# Altium schematic sheet med_filter.SchDoc
size A
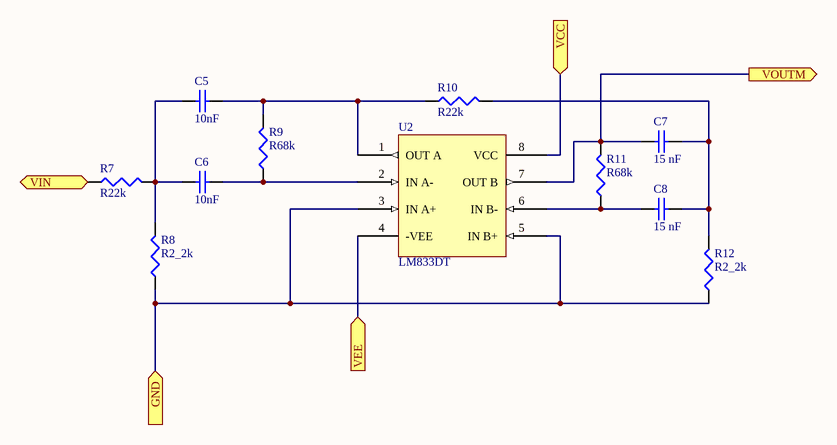
[diagram p0: med_filter.SchDoc]

## Parts
C5  10nF  [C0603]
C6  10nF  [C0603]
C7  15 nF  [C0603]
C8  15 nF  [C0603]
R7  R22k  [R0603]
R8  R2_2k  [R0603]
R9  R68k  [R0603]
R10  R22k  [R0603]
R11  R68k  [R0603]
R12  R2_2k  [R0603]
U2  LM833DT  [soic8]

## Ports
GND (in), VCC (in), VEE (in), VIN (in), VOUTM (out)

## Nets
GND: R8.1 R12.1 U2.3(IN_A+) U2.5(IN_B+) ; port GND
VCC: U2.8(VCC) ; port VCC
VEE: U2.4(-VEE) ; port VEE
VIN: R7.1 ; port VIN
VOUTM: C7.1 R11.2 U2.7(OUT_B) ; port VOUTM
NetC5_1: C5.1 C6.1 R7.2 R8.2
NetC5_2: C5.2 R9.2 R10.1 U2.1(OUT_A)
NetC6_2: C6.2 R9.1 U2.2(IN_A-)
NetC7_2: C7.2 C8.2 R10.2 R12.2
NetC8_1: C8.1 R11.1 U2.6(IN_B-)

## Library data of the parts
C5 C6 = C10nF: 10 nF Surface Mount Capacitor; Manufacturer: Murata Electronics North America; Manufacturer Part Number: GRM188R70J103KA01D; Capacitance: 10000pF; Tolerance: ±10%; Voltage - Rated: 6.3V; Temperature Coefficient: X7R; Supplier 1: Digi-Key; RoHS: RoHS Compliant; Category: Capacitors; Stock 1: 37902; Pricing 1: 1=0.1, 10=0.049, 50=0.0266, 100=0.0226, 250=0.01844, 500=0.01578, 1000=0.0123 (USD); Packaging: Digi-Reel®; Part Status: Active; Operating Temperature: -55°C ~ 125°C; Features: -; Ratings: -; Applications: General Purpose; Mounting Type: Surface Mount, MLCC; Package / Case: 0603 (1608 Metric); Size / Dimension: 0.063" L x 0.031" W (1.60mm x 0.80mm); Height - Seated (Max): -; Thickness (Max): 0.035" (0.90mm); Lead Spacing: -; Lead Style: -; ComponentLink1URL: http://www.murata.com/~/media/webrenewal/support/library/catalog/products/capacitor/mlcc/c02e.pdf; ComponentLink1Description: http://www.murata.com/~/media/webrenewal/support/library/catalog/products/capacitor/mlcc/c02e.pdf; Supplier Part Number 1: 490-9729-6-ND
C7 C8 = C15nF: 15 nF Surface Mount Capacitor; Manufacturer: Murata Electronics North America; Manufacturer Part Number: GRM188R71H153KA01D; Capacitance: 0.015µF; Tolerance: ±10%; Voltage - Rated: 50V; Temperature Coefficient: X7R; Supplier 1: Digi-Key; RoHS: RoHS Compliant; Category: Capacitors; Stock 1: 98716; Pricing 1: 1=0.1, 10=0.043, 50=0.0234, 100=0.0198, 250=0.0162, 500=0.01386, 1000=0.0108 (USD); Packaging: Digi-Reel®; Part Status: Active; Operating Temperature: -55°C ~ 125°C; Features: -; Ratings: -; Applications: General Purpose; Mounting Type: Surface Mount, MLCC; Package / Case: 0603 (1608 Metric); Size / Dimension: 0.063" L x 0.031" W (1.60mm x 0.80mm); Height - Seated (Max): -; Thickness (Max): 0.035" (0.90mm); Lead Spacing: -; Lead Style: -; ComponentLink1URL: http://www.murata.com/~/media/webrenewal/support/library/catalog/products/capacitor/mlcc/c02e.pdf; ComponentLink1Description: http://www.murata.com/~/media/webrenewal/support/library/catalog/products/capacitor/mlcc/c02e.pdf; Supplier Part Number 1: 490-1514-6-ND
R7 R10 = R22k: 22k Ohms Surface Mount Resistor; Manufacturer: Yageo; Manufacturer Part Number: RC0603FR-0722KL; Tolerance: ±1%; Power (Watts): 0.1W, 1/10W; Temperature Coefficient: ±100ppm/°C; Supplier 1: Digi-Key; RoHS: RoHS Compliant; Category: Resistors; Stock 1: 2279950; Pricing 1: 1=0.1, 10=0.013, 25=0.0092, 50=0.007, 100=0.0052, 250=0.00396, 500=0.00316, 1000=0.00233 (USD); Packaging: Digi-Reel®; Part Status: Active; Resistance (Ohms): 22k; Composition: Thick Film; Features: Moisture Resistant; Operating Temperature: -55°C ~ 155°C; Package / Case: 0603 (1608 Metric); Supplier Device Package: 0603; Size / Dimension: 0.063" L x 0.031" W (1.60mm x 0.80mm); Height - Seated (Max): 0.022" (0.55mm); Number of Terminations: 2; Failure Rate: -; ComponentLink1URL: http://www.yageo.com/NewPortal/yageodocoutput?fileName=/pdf/R-Chip/PYu-RC_Group_51_RoHS_L_4.pdf; ComponentLink1Description: http://www.yageo.com/NewPortal/yageodocoutput?fileName=/pdf/R-Chip/PYu-RC_Group_51_RoHS_L_4.pdf; Supplier Part Number 1: 311-22.0KHRDKR-ND
R8 R12 = R2_2k: 2.2k Ohms Surface Mount Resistor; Manufacturer: Yageo; Manufacturer Part Number: RC0603FR-072K2L; Tolerance: ±1%; Power (Watts): 0.1W, 1/10W; Temperature Coefficient: ±100ppm/°C; Supplier 1: Digi-Key; RoHS: RoHS Compliant; Category: Resistors; Stock 1: 4524664; Pricing 1: 1=0.1, 10=0.013, 25=0.0092, 50=0.007, 100=0.0052, 250=0.00396, 500=0.00316, 1000=0.00233 (USD); Packaging: Digi-Reel®; Part Status: Active; Resistance (Ohms): 2.2k; Composition: Thick Film; Features: Moisture Resistant; Operating Temperature: -55°C ~ 155°C; Package / Case: 0603 (1608 Metric); Supplier Device Package: 0603; Size / Dimension: 0.063" L x 0.031" W (1.60mm x 0.80mm); Height - Seated (Max): 0.022" (0.55mm); Number of Terminations: 2; Failure Rate: -; ComponentLink1URL: http://www.yageo.com/NewPortal/yageodocoutput?fileName=/pdf/R-Chip/PYu-RC_Group_51_RoHS_L_4.pdf; ComponentLink1Description: http://www.yageo.com/NewPortal/yageodocoutput?fileName=/pdf/R-Chip/PYu-RC_Group_51_RoHS_L_4.pdf; Supplier Part Number 1: 311-2.20KHRDKR-ND
R9 R11 = R68k: 68k Ohms Surface Mount Resistor; Manufacturer: Panasonic Electronic Components; Manufacturer Part Number: ERJ-3EKF6802V; Tolerance: ±1%; Power (Watts): 0.1W, 1/10W; Temperature Coefficient: ±100ppm/°C; Supplier 1: Digi-Key; RoHS: RoHS Compliant; Category: Resistors; Stock 1: 139857; Pricing 1: 1=0.1, 10=0.019, 25=0.0136, 50=0.0104, 100=0.0077, 250=0.00584, 500=0.00468, 1000=0.00345 (USD); Packaging: Cut Tape (CT); Part Status: Active; Resistance (Ohms): 68k; Composition: Thick Film; Features: Automotive AEC-Q200; Operating Temperature: -55°C ~ 155°C; Package / Case: 0603 (1608 Metric); Supplier Device Package: 0603; Size / Dimension: 0.063" L x 0.031" W (1.60mm x 0.80mm); Height - Seated (Max): 0.022" (0.55mm); Number of Terminations: 2; Failure Rate: -; ComponentLink1URL: https://industrial.panasonic.com/cdbs/www-data/pdf/RDA0000/AOA0000C283.pdf; ComponentLink1Description: https://industrial.panasonic.com/cdbs/www-data/pdf/RDA0000/AOA0000C283.pdf; Supplier Part Number 1: P68.0KHCT-ND
U2 = LM833DT: IC Dual Audio Amplifier; Manufacturer: STMicroelectronics; Number of Circuits: 2; Slew Rate: 7 V/µs; Gain Bandwidth Product: 15MHz; Current - Input Bias: 300nA; Voltage - Input Offset: 300µV; Current - Supply: 4mA; Voltage - Supply, Single/Dual (±): 5 V ~ 30 V, ±2.5 V ~ 15 V; Supplier 1: Digi-Key; Manufacturer Part Number: LM833DT; RoHS: RoHS Compliant; Category: Integrated Circuits (ICs); Stock 1: 35363; Pricing 1: 1=0.45, 10=0.382, 100=0.2855, 500=0.22434, 1000=0.17335 (USD); Packaging: Cut Tape (CT); Part Status: Active; Amplifier Type: Audio; Output Type: -; -3db Bandwidth: -; Current - Output / Channel: -; Operating Temperature: -40°C ~ 105°C; Mounting Type: Surface Mount; Package / Case: 8-SOIC (0.154", 3.90mm Width); Supplier Device Package: 8-SO; ComponentLink1URL: http://www.st.com/content/ccc/resource/technical/document/datasheet/3b/52/12/a5/70/7c/44/0a/CD00000470.pdf/files/CD00000470.pdf/jcr:content/translations/en.CD00000470.pdf; ComponentLink1Description: http://www.st.com/content/ccc/resource/technical/document/datasheet/3b/52/12/a5/70/7c/44/0a/CD00000470.pdf/files/CD00000470.pdf/jcr:content/translations/en.CD00000470.pdf; Supplier Part Number 1: 497-1597-1-ND